# EAGLE schematic pocketbeagle-breakout (EAGLE 9.2.2)
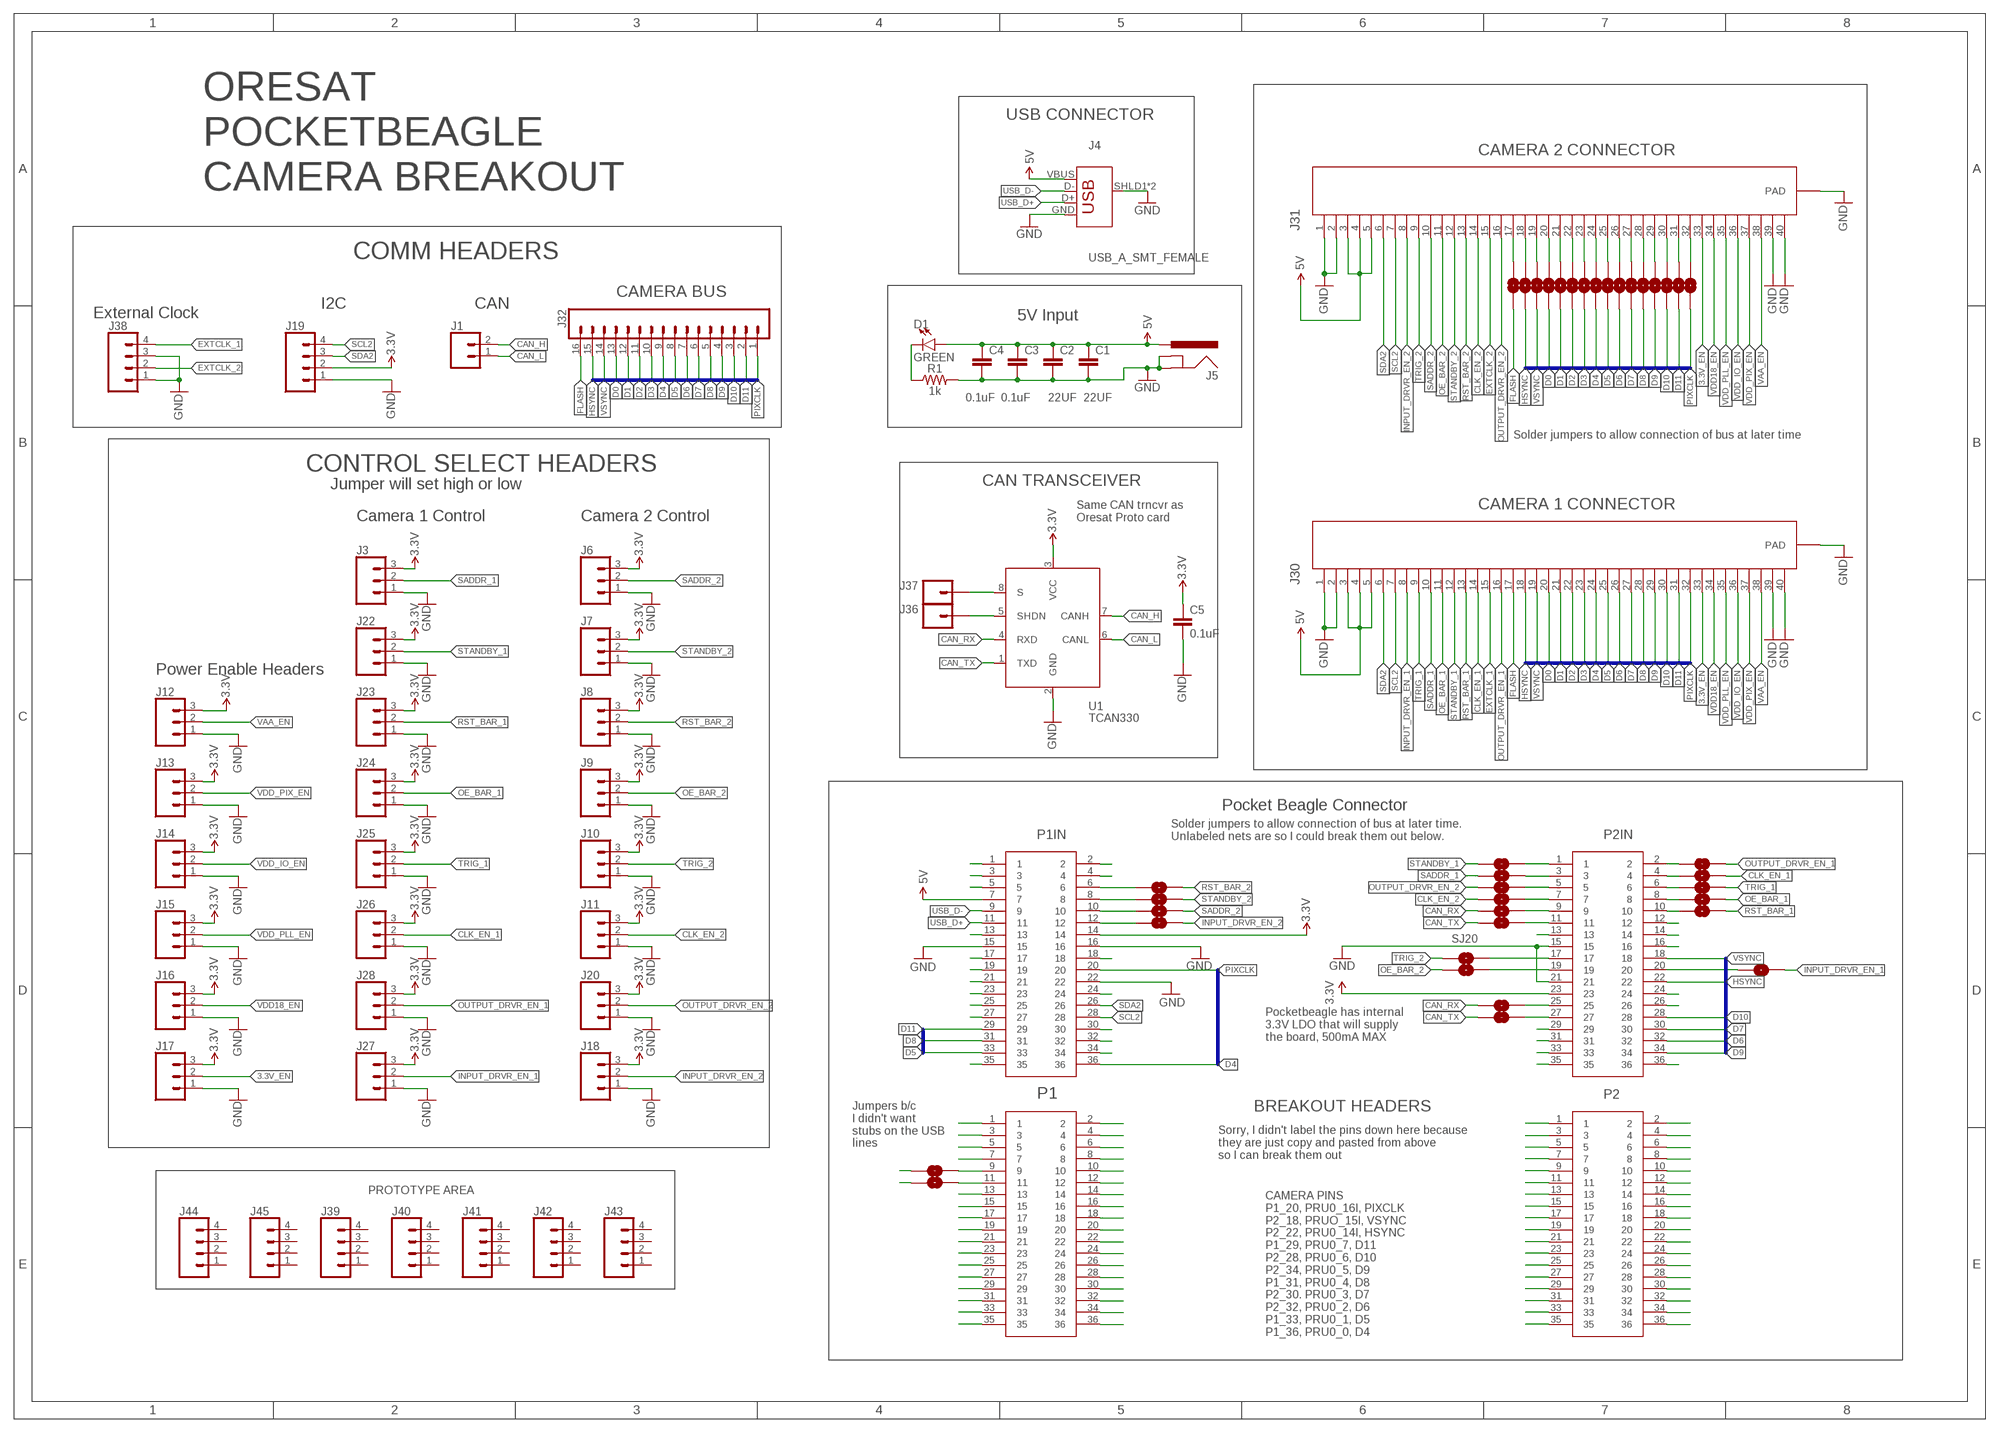
[diagram p0: schematic, sheet 1]

## Parts
C1  22UF  22UF-1210-16V-20%  [1210]
C2  22UF  22UF-1210-16V-20%  [1210]
C3  0.1uF  0.1UF-0603-100V-10%  [0603]
C4  0.1uF  0.1UF-0603-100V-10%  [0603]
C5  0.1uF  0.1UF-0603-100V-10%  [0603]
D1  GREEN  LED-GREEN0603  [LED-0603]
J1  CONN_025MM  [SCREWTERMINAL-5MM-2]
J3  CONN_031X03_NO_SILK  [1X03_NO_SILK]
J4  USB_A_SMT_FEMALE  [USB-A-S-SILK-FEMALE]
J5  POWER_JACK  [POWER_JACK_PTH]
J6  CONN_031X03_NO_SILK  [1X03_NO_SILK]
J7  CONN_031X03_NO_SILK  [1X03_NO_SILK]
J8  CONN_031X03_NO_SILK  [1X03_NO_SILK]
J9  CONN_031X03_NO_SILK  [1X03_NO_SILK]
J10  CONN_031X03_NO_SILK  [1X03_NO_SILK]
J11  CONN_031X03_NO_SILK  [1X03_NO_SILK]
J12  CONN_031X03_NO_SILK  [1X03_NO_SILK]
J13  CONN_031X03_NO_SILK  [1X03_NO_SILK]
J14  CONN_031X03_NO_SILK  [1X03_NO_SILK]
J15  CONN_031X03_NO_SILK  [1X03_NO_SILK]
J16  CONN_031X03_NO_SILK  [1X03_NO_SILK]
J17  CONN_031X03_NO_SILK  [1X03_NO_SILK]
J18  CONN_031X03_NO_SILK  [1X03_NO_SILK]
J19  CONN_041X04_NO_SILK  [1X04_NO_SILK]
J20  CONN_031X03_NO_SILK  [1X03_NO_SILK]
J22  CONN_031X03_NO_SILK  [1X03_NO_SILK]
J23  CONN_031X03_NO_SILK  [1X03_NO_SILK]
J24  CONN_031X03_NO_SILK  [1X03_NO_SILK]
J25  CONN_031X03_NO_SILK  [1X03_NO_SILK]
J26  CONN_031X03_NO_SILK  [1X03_NO_SILK]
J27  CONN_031X03_NO_SILK  [1X03_NO_SILK]
J28  CONN_031X03_NO_SILK  [1X03_NO_SILK]
J30  4-1734592-04-1734592-0  [TE_4-1734592-0]
J31  4-1734592-04-1734592-0  [TE_4-1734592-0]
J32  CONN_161X16_NO_SILK  [1X16_NO_SILK]
J36  CONN_01PTH_NO_SILK_YES_STOP  [1X01_NO_SILK]
J37  CONN_01PTH_NO_SILK_YES_STOP  [1X01_NO_SILK]
J38  CONN_041X04_NO_SILK  [1X04_NO_SILK]
J39  CONN_041X04_NO_SILK  [1X04_NO_SILK]
J40  CONN_041X04_NO_SILK  [1X04_NO_SILK]
J41  CONN_041X04_NO_SILK  [1X04_NO_SILK]
J42  CONN_041X04_NO_SILK  [1X04_NO_SILK]
J43  CONN_041X04_NO_SILK  [1X04_NO_SILK]
J44  CONN_041X04_NO_SILK  [1X04_NO_SILK]
J45  CONN_041X04_NO_SILK  [1X04_NO_SILK]
P1  BCS-118-L-D-TE  [CON36_2X18_TU_BCS]
P1IN  BCS-118-L-D-TE  [CON36_2X18_TU_BCS]
P2  BCS-118-L-D-TE  [CON36_2X18_TU_BCS]
P2IN  BCS-118-L-D-TE  [CON36_2X18_TU_BCS]
R1  1k  1KOHM-0603-1/10W-1%  [0603]
SJ1  SOLDERJUMPERNC2  [SJ_2S-NOTRACE]
SJ2  SOLDERJUMPERNC2  [SJ_2S-NOTRACE]
SJ3  SOLDERJUMPERNC2  [SJ_2S-NOTRACE]
SJ4  SOLDERJUMPERNC2  [SJ_2S-NOTRACE]
SJ5  SOLDERJUMPERNC2  [SJ_2S-NOTRACE]
SJ6  SOLDERJUMPERNC2  [SJ_2S-NOTRACE]
SJ7  SOLDERJUMPERNC2  [SJ_2S-NOTRACE]
SJ8  SOLDERJUMPERNC2  [SJ_2S-NOTRACE]
SJ9  SOLDERJUMPERNC2  [SJ_2S-NOTRACE]
SJ10  SOLDERJUMPERNC2  [SJ_2S-NOTRACE]
SJ11  SOLDERJUMPERNC2  [SJ_2S-NOTRACE]
SJ12  SOLDERJUMPERNC2  [SJ_2S-NOTRACE]
SJ13  SOLDERJUMPERNC2  [SJ_2S-NOTRACE]
SJ14  SOLDERJUMPERNC2  [SJ_2S-NOTRACE]
SJ15  SOLDERJUMPERNC2  [SJ_2S-NOTRACE]
SJ16  SOLDERJUMPERNC2  [SJ_2S-NOTRACE]
SJ17  SOLDERJUMPERNC  [SJ_2S]
SJ18  SOLDERJUMPERNC  [SJ_2S]
SJ19  SOLDERJUMPERTRACE  [SJ_2S-TRACE]
SJ20  SOLDERJUMPERTRACE  [SJ_2S-TRACE]
SJ21  SOLDERJUMPERNC  [SJ_2S]
SJ22  SOLDERJUMPERNC  [SJ_2S]
SJ23  SOLDERJUMPERNC  [SJ_2S]
SJ24  SOLDERJUMPERNC  [SJ_2S]
SJ25  SOLDERJUMPERNC  [SJ_2S]
SJ26  SOLDERJUMPERNC  [SJ_2S]
SJ27  SOLDERJUMPERNC  [SJ_2S]
SJ28  SOLDERJUMPERNC  [SJ_2S]
SJ29  SOLDERJUMPERNC  [SJ_2S]
SJ30  SOLDERJUMPERNC  [SJ_2S]
SJ31  SOLDERJUMPERNC  [SJ_2S]
SJ32  SOLDERJUMPERNC  [SJ_2S]
SJ33  SOLDERJUMPERNC  [SJ_2S]
SJ34  SOLDERJUMPERNC  [SJ_2S]
SJ35  SOLDERJUMPERNC  [SJ_2S]
SJ36  SOLDERJUMPERNC  [SJ_2S]
SJ37  SOLDERJUMPERNC  [SJ_2S]
SJ38  SOLDERJUMPERNC  [SJ_2S]
U1  TCAN330  [SOT23-8_TI-DCN]

## Nets
3.3V: C5.1 J3.3 J6.3 J7.3 J8.3 J9.3 J10.3 J11.3 J12.3 J13.3 J14.3 J15.3 J16.3 J17.3 J18.3 J19.2 J20.3 J22.3 J23.3 J24.3 J25.3 J26.3 J27.3 J28.3 P1.14 P1IN.14 P2.23 P2IN.23 U1.3(VCC)
3.3V_EN: J17.2 J30.33 J31.33
5V: C1.1 C2.1 C3.1 C4.1 D1.A J4.VBUS J5.PWR J30.3 J30.4 J30.5 J31.3 J31.4 J31.5 P1.7 P1IN.7
CAN_H: J1.2 U1.7(CANH)
CAN_L: J1.1 U1.6(CANL)
CAN_RX: SJ17.2 SJ19.2 U1.4(RXD)
CAN_TX: SJ18.2 SJ20.2 U1.1(TXD)
CLK_EN_1: J26.2 J30.14 SJ36.1
CLK_EN_2: J11.2 J31.14 SJ29.2
D0: J30.20 J32.13 SJ15.1
D1: J30.21 J32.12 SJ14.1
D2: J30.22 J32.11 SJ13.1
D3: J30.23 J32.10 SJ12.1
D4: J30.24 J32.9 P1.36 P1IN.36 SJ11.1
D5: J30.25 J32.8 P1.33 P1IN.33 SJ10.1
D6: J30.26 J32.7 P2.32 P2IN.32 SJ9.1
D7: J30.27 J32.6 P2.30 P2IN.30 SJ8.1
D8: J30.28 J32.5 P1.31 P1IN.31 SJ7.1
D9: J30.29 J32.4 P2.34 P2IN.34 SJ6.1
D10: J30.30 J32.3 P2.28 P2IN.28 SJ5.1
D11: J30.31 J32.2 P1.29 P1IN.29 SJ4.1
EXTCLK_1: J30.15 J38.4
EXTCLK_2: J31.15 J38.2
FLASH: J30.17 J32.16 SJ16.2
GND: C1.2 C2.2 C3.2 C4.2 C5.2 J3.1 J4.GND J4.SHLD1(SHIELD) J4.SHLD2(SHIELD) J5.GND J5.GNDBREAK J6.1 J7.1 J8.1 J9.1 J10.1 J11.1 J12.1 J13.1 J14.1 J15.1 J16.1 J17.1 J18.1 J19.1 J20.1 J22.1 J23.1 J24.1 J25.1 J26.1 J27.1 J28.1 J30.1 J30.2 J30.39 J30.40 J30.S1(PAD) J30.S2(PAD) J31.1 J31.2 J31.39 J31.40 J31.S1(PAD) J31.S2(PAD) J38.1 J38.3 P1.15 P1.16 P1.22 P1IN.15 P1IN.16 P1IN.22 P2.15 P2.21 P2IN.15 P2IN.21 R1.2 U1.2(GND)
HSYNC: J30.18 J32.15 P2.22 P2IN.22 SJ3.1
INPUT_DRVR_EN_1: J27.2 J30.8 SJ35.2
INPUT_DRVR_EN_2: J18.2 J31.8 SJ33.1
N$1: P2.2 P2IN.2 SJ34.1
N$2: J31.17 SJ16.1
N$3: J31.18 SJ3.2
N$4: J31.19 SJ2.2
N$5: J31.20 SJ15.2
N$6: J31.21 SJ14.2
N$7: J31.22 SJ13.2
N$8: J31.23 SJ12.2
N$9: J31.24 SJ11.2
N$10: J31.25 SJ10.2
N$11: J31.26 SJ9.2
N$12: J31.27 SJ8.2
N$13: J31.28 SJ7.2
N$14: J31.29 SJ6.2
N$15: J31.30 SJ5.2
N$16: J31.31 SJ4.2
N$17: J31.32 SJ1.2
N$18: J36.1 U1.5(SHDN)
N$19: J37.1 U1.8(S)
N$20: P2.9 P2IN.9 SJ19.1
N$21: P2.11 P2IN.11 SJ20.1
N$22: P2.25 P2IN.25 SJ17.1
N$23: P2.27 P2IN.27 SJ18.1
N$24: D1.C R1.1
N$25: P2.1 P2IN.1 SJ22.2
N$26: P2.10 P2IN.10 SJ23.2
N$27: P2.8 P2IN.8 SJ24.2
N$28: P2.6 P2IN.6 SJ25.2
N$29: P2.17 P2IN.17 SJ26.1
N$30: P2.19 P2IN.19 SJ27.1
N$31: P2.5 P2IN.5 SJ28.1
N$32: P2.7 P2IN.7 SJ29.1
N$33: P1.12 P1IN.12 SJ33.2
N$34: P1.10 P1IN.10 SJ32.2
N$35: P1.8 P1IN.8 SJ31.2
N$36: P1.6 P1IN.6 SJ30.2
N$37: P2.20 P2IN.20 SJ35.1
N$38: P2.4 P2IN.4 SJ36.2
N$39: P1.9 SJ37.1
N$40: P1.11 SJ38.1
N$41: P1.27 P1IN.27
N$42: P1.25 P1IN.25
N$43: P1.23 P1IN.23
N$44: P1.21 P1IN.21
N$45: P1.19 P1IN.19
N$46: P1.17 P1IN.17
N$47: P1.13 P1IN.13
N$48: P1.5 P1IN.5
N$49: P1.3 P1IN.3
N$50: P1.1 P1IN.1
N$51: P1.35 P1IN.35
N$52: P1.34 P1IN.34
N$53: P1.32 P1IN.32
N$54: P1.30 P1IN.30
N$55: P1.24 P1IN.24
N$56: P1.18 P1IN.18
N$57: P1.4 P1IN.4
N$58: P2.3 P2IN.3 SJ21.2
N$59: P1.2 P1IN.2
N$60: P2.13 P2IN.13
N$61: P2.29 P2IN.29
N$62: P2.31 P2IN.31
N$63: P2.33 P2IN.33
N$64: P2.35 P2IN.35
N$65: P2.12 P2IN.12
N$66: P2.14 P2IN.14
N$67: P2.16 P2IN.16
N$68: P2.24 P2IN.24
N$69: P2.26 P2IN.26
N$70: P2.36 P2IN.36
OE_BAR_1: J24.2 J30.11 SJ24.1
OE_BAR_2: J9.2 J31.11 SJ27.2
OUTPUT_DRVR_EN_1: J28.2 J30.16 SJ34.2
OUTPUT_DRVR_EN_2: J20.2 J31.16 SJ28.2
PIXCLK: J30.32 J32.1 P1.20 P1IN.20 SJ1.1
RST_BAR_1: J23.2 J30.13 SJ23.1
RST_BAR_2: J8.2 J31.13 SJ30.1
SADDR_1: J3.2 J30.10 SJ21.1
SADDR_2: J6.2 J31.10 SJ32.1
SCL2: J19.4 J30.7 J31.7 P1.28 P1IN.28
SDA2: J19.3 J30.6 J31.6 P1.26 P1IN.26
STANDBY_1: J22.2 J30.12 SJ22.1
STANDBY_2: J7.2 J31.12 SJ31.1
TRIG_1: J25.2 J30.9 SJ25.1
TRIG_2: J10.2 J31.9 SJ26.2
USB_D+: J4.D+ P1IN.11 SJ38.2
USB_D-: J4.D- P1IN.9 SJ37.2
VAA_EN: J12.2 J30.38 J31.38
VDD18_EN: J16.2 J30.34 J31.34
VDD_IO_EN: J14.2 J30.36 J31.36
VDD_PIX_EN: J13.2 J30.37 J31.37
VDD_PLL_EN: J15.2 J30.35 J31.35
VSYNC: J30.19 J32.14 P2.18 P2IN.18 SJ2.1
Unconnected: J39.1 J39.2 J39.3 J39.4 J40.1 J40.2 J40.3 J40.4 J41.1 J41.2 J41.3 J41.4 J42.1 J42.2 J42.3 J42.4 J43.1 J43.2 J43.3 J43.4 J44.1 J44.2 J44.3 J44.4 J45.1 J45.2 J45.3 J45.4

## Buses
D[0..11],HSYNC,PIXCLK,VSYNC

## Notes on the sheet
- USB CONNECTOR
- CAMERA 2 CONNECTOR
- ORESAT
  POCKETBEAGLE
  CAMERA BREAKOUT
- COMM HEADERS
- CAMERA BUS
- I2C | CAN
- External Clock | 5V Input
- Solder jumpers to allow connection of bus at later time
- CONTROL SELECT HEADERS
- Jumper will set high or low | CAN TRANSCEIVER
- CAMERA 1 CONNECTOR
- Camera 1 Control | Camera 2 Control
- Same CAN trncvr as 
  Oresat Proto card
- Power Enable Headers
- Pocket Beagle Connector
- Solder jumpers to allow connection of bus at later time.
  Unlabeled nets are so I could break them out below.
- Pocketbeagle has internal
  3.3V LDO that will supply
  the board, 500mA MAX
- BREAKOUT HEADERS
- Jumpers b/c
  I didn't want
  stubs on the USB
  lines
- Sorry, I didn't label the pins down here because 
  they are just copy and pasted from above
  so I can break them out
- PROTOTYPE AREA
- CAMERA PINS
  P1_20, PRU0_16I, PIXCLK
  P2_18, PRUO_15I, VSYNC
  P2_22, PRU0_14I, HSYNC
  P1_29, PRU0_7, D11
  P2_28, PRU0_6, D10
  P2_34, PRU0_5, D9
  P1_31, PRU0_4, D8
  P2_30. PRU0_3, D7
  P2_32, PRU0_2, D6
  P1_33, PRU0_1, D5
  P1_36, PRU0_0, D4

## Library data of the parts
C1 C2 = SparkFun-Capacitors:22UF: 22µF ceramic capacitors A capacitor is a passive two-terminal electrical component used to store electrical energy temporarily in an electric field.
C3-C5 = SparkFun-Capacitors:0.1UF: 0.1µF ceramic capacitors A capacitor is a passive two-terminal electrical component used to store electrical energy temporarily in an electric field.; PROD_ID: CAP-08390
D1 = SparkFun-LED:LED-GREEN: Green SMD LED Used in manufacturing of various products at SparkFun Packages: 0603 - SMD 0603 package [Product Link] <http://www.futureelectronics.com/en/technologies/semiconductors/optoelectronics/leds/Pages/9894312-LTST-C190GKT.aspx?CrossPart=HSMG-C190&IM=0> LilyPad 1206 - SMD1206 LilyPad package [Product Link] <http://www.futureelectronics.com/en/Technologies/Product.aspx?ProductID=IN150NGHARVATEKCORPORATION2049943&IM=0> 1206 - SMD1206 package [Product Link] <http://www.futureelectronics.com/en/technologies/semiconductors/optoelectronics/leds/Pages/8315665-LTST-C150KGKT.aspx?IM=0> 1206 Bottom Mount -SMD 1206 Bottom Mount [Product Link] <http://www.digikey.com/product-detail/en/lite-on-inc/LTST-C230KGKT/160-1456-1-ND/386854> SparkFun Products: Pro Mini 328 -5V <https://www.sparkfun.com/products/821> RedBoard <https://www.sparkfun.com/products/12757> MP3 Trigger <https://www.sparkfun.com/products/13720> Makey Makey <https://www.sparkfun.com/products/11076>; PROD_ID: DIO-00821
J1 = SparkFun-Connectors:CONN_02: Multi connection point. Often used as Generic Header-pin footprint for 0.1 inch spaced/style header connections On any of the 0.1 inch spaced packages, you can populate with these: Break Away Headers - Straight <https://www.sparkfun.com/products/116> (PRT-00116) Break Away Male Headers - Right Angle <https://www.sparkfun.com/products/553> (PRT-00553) Female Headers <https://www.sparkfun.com/products/115> (PRT-00115) Break Away Headers - Machine Pin <https://www.sparkfun.com/products/117> (PRT-00117) Break Away Female Headers - Swiss Machine Pin <https://www.sparkfun.com/products/743> (PRT-00743) For SCREWTERMINALS and SPRING TERMINALS visit here: Screw Terimnals on SparkFun.com <https://www.sparkfun.com/search/results?term=Screw+Terminals> (5mm/3.5mm/2.54mm spacing) This device is also useful as a general connection point to wire up your design to another part of your project. Our various solder wires solder well into these plated through hole pads. Hook-Up Wire - Assortment (Stranded, 22 AWG) <https://www.sparkfun.com/products/11375> (PRT-11375) Hook-Up Wire - Assortment (Solid Core, 22 AWG) <https://www.sparkfun.com/products/11367> (PRT-11367) View the entire wire category on our website here <https://www.sparkfun.com/categories/141> Special notes: Molex polarized connector foot print use with: PRT-08233 with associated crimp pins and housings. 2.54_SCREWTERM for use with PRT-10571. 3.5mm Screw Terminal footprints for PRT-08084 5mm Screw Terminal footprints for use with PRT-08432; SF_SKU: PRT-08432
J3 J6-J18 J20 J22-J28 = SparkFun-Connectors:CONN_03: Multi connection point. Often used as Generic Header-pin footprint for 0.1 inch spaced/style header connections On any of the 0.1 inch spaced packages, you can populate with these: Break Away Headers - Straight <https://www.sparkfun.com/products/116> (PRT-00116) Break Away Male Headers - Right Angle <https://www.sparkfun.com/products/553> (PRT-00553) Female Headers <https://www.sparkfun.com/products/115> (PRT-00115) Break Away Headers - Machine Pin <https://www.sparkfun.com/products/117> (PRT-00117) Break Away Female Headers - Swiss Machine Pin <https://www.sparkfun.com/products/743> (PRT-00743) Stackable Header - 3 Pin (Female, 0.1") <https://www.sparkfun.com/products/13875> (PRT-13875) For SCREWTERMINALS and SPRING TERMINALS visit here: Screw Terimnals on SparkFun.com <https://www.sparkfun.com/search/results?term=Screw+Terminals> (5mm/3.5mm/2.54mm spacing) This device is also useful as a general connection point to wire up your design to another part of your project. Our various solder wires solder well into these plated through hole pads. Hook-Up Wire - Assortment (Stranded, 22 AWG) <https://www.sparkfun.com/products/11375> (PRT-11375) Hook-Up Wire - Assortment (Solid Core, 22 AWG) <https://www.sparkfun.com/products/11367> (PRT-11367) View the entire wire category on our website here <https://www.sparkfun.com/categories/141> Special notes: Molex polarized connector foot print use with SKU : PRT-08232 with associated crimp pins and housings.
J4 = SparkFun-Connectors:USB_A: USB-A Connector Male and female variants, as well as PTH and SMT variants SparkFun Products: SparkFun XBee Explorer Dongle <https://www.sparkfun.com/products/11697> PTH Male SparkFun MicroView-USB Programmer <https://www.sparkfun.com/products/12924> SMT Male SparkFun USB Type A Female Breakout <https://www.sparkfun.com/products/12700> SMT Female; PROD_ID: CONN-09520; SF_ID: PRT-09011
J5 = SparkFun-Connectors:POWER_JACK: Power Jack Connector This is the standard 5.5mm barrel jack for power. The PTH is the most common, proven, reliable, footprint. The Slot footprint only works if the mill layer is transmitted to the PCB fab house so be warned. Here are the connectors we sell at SparkFun: DC Barrel Power Jack/Connector <https://www.sparkfun.com/products/119> (PRT-00119) DC Barrel Power Jack/Connector (SMD) <https://www.sparkfun.com/products/12748> (PRT-12748) DC Barrel Jack Adapter - Breadboard Compatible <https://www.sparkfun.com/products/10811> (PRT-10811) It is used on this SparkFun product (and many, many others): SparkFun RedBoard - Programmed with Arduino <https://www.sparkfun.com/products/12757> (DEV-12757) Also, if you need a mating power supply or connector, please check these out: Wall Adapter Power Supply - 9VDC 650mA <https://www.sparkfun.com/products/298> (TOL-00298) DC Barrel Jack Adapter - Male <https://www.sparkfun.com/products/10287> (PRT-10287); PROD_ID: CONN-08197
J19 J38-J45 = SparkFun-Connectors:CONN_04: Multi connection point. Often used as Generic Header-pin footprint for 0.1 inch spaced/style header connections On any of the 0.1 inch spaced packages, you can populate with these: Break Away Headers - Straight <https://www.sparkfun.com/products/116> (PRT-00116) Break Away Male Headers - Right Angle <https://www.sparkfun.com/products/553> (PRT-00553) Female Headers <https://www.sparkfun.com/products/115> (PRT-00115) Break Away Headers - Machine Pin <https://www.sparkfun.com/products/117> (PRT-00117) Break Away Female Headers - Swiss Machine Pin <https://www.sparkfun.com/products/743> (PRT-00743) For SCREWTERMINALS and SPRING TERMINALS visit here: Screw Terimnals on SparkFun.com <https://www.sparkfun.com/search/results?term=Screw+Terminals> (5mm/3.5mm/2.54mm spacing) This device is also useful as a general connection point to wire up your design to another part of your project. Our various solder wires solder well into these plated through hole pads. Hook-Up Wire - Assortment (Stranded, 22 AWG) <https://www.sparkfun.com/products/11375> (PRT-11375) Hook-Up Wire - Assortment (Solid Core, 22 AWG) <https://www.sparkfun.com/products/11367> (PRT-11367) View the entire wire category on our website here <https://www.sparkfun.com/categories/141> Special notes: Molex polarized connector foot print use with SKU : PRT-08231 with associated crimp pins and housings. 1MM SMD Version SKU: PRT-10208; PROD_ID: CONN-09696
J30 J31 = Oliver_Custom:4-1734592-0
J32 = SparkFun-Connectors:CONN_16: Multi connection point. Often used as Generic Header-pin footprint for 0.1 inch spaced/style header connections On any of the 0.1 inch spaced packages, you can populate with these: Break Away Headers - Straight <https://www.sparkfun.com/products/116> (PRT-00116) Break Away Male Headers - Right Angle <https://www.sparkfun.com/products/553> (PRT-00553) Female Headers <https://www.sparkfun.com/products/115> (PRT-00115) Break Away Headers - Machine Pin <https://www.sparkfun.com/products/117> (PRT-00117) Break Away Female Headers - Swiss Machine Pin <https://www.sparkfun.com/products/743> (PRT-00743) For SCREWTERMINALS and SPRING TERMINALS visit here: Screw Terimnals on SparkFun.com <https://www.sparkfun.com/search/results?term=Screw+Terminals> (5mm/3.5mm/2.54mm spacing) This device is also useful as a general connection point to wire up your design to another part of your project. Our various solder wires solder well into these plated through hole pads. Hook-Up Wire - Assortment (Stranded, 22 AWG) <https://www.sparkfun.com/products/11375> (PRT-11375) Hook-Up Wire - Assortment (Solid Core, 22 AWG) <https://www.sparkfun.com/products/11367> (PRT-11367) View the entire wire category on our website here <https://www.sparkfun.com/categories/141> Special notes: Molex polarized connector foot print use with SKU : PRT-08231 with associated crimp pins and housings. 1MM SMD Version SKU: PRT-10208 NOTES ON THE VARIANTS LOCK and LOCK_LONGPADS... This footprint was designed to help hold the alignment of a through-hole component (i.e. 6-pin header) while soldering it into place. You may notice that each hole has been shifted either up or down by 0.005 of an inch from it's more standard position (which is a perfectly straight line). This slight alteration caused the pins (the squares in the middle) to touch the edges of the holes. Because they are alternating, it causes a "brace" to hold the component in place. 0.005 has proven to be the perfect amount of "off-center" position when using our standard breakaway headers. Although looks a little odd when you look at the bare footprint, once you have a header in there, the alteration is very hard to notice. Also,if you push a header all the way into place, it is covered up entirely on the bottom side.
J36 J37 = SparkFun-Connectors:CONN_01: Single connection point. Often used as Generic Header-pin footprint for 0.1 inch spaced/style header connections On any of the 0.1 inch spaced packages, you can populate with these: Break Away Headers - Straight <https://www.sparkfun.com/products/116> (PRT-00116) Break Away Male Headers - Right Angle <https://www.sparkfun.com/products/553> (PRT-00553) Female Headers <https://www.sparkfun.com/products/115> (PRT-00115) Break Away Headers - Machine Pin <https://www.sparkfun.com/products/117> (PRT-00117) Break Away Female Headers - Swiss Machine Pin <https://www.sparkfun.com/products/743> (PRT-00743) This device is also useful as a general connection point to wire up your design to another part of your project. Our various solder wires solder well into these plated through hole pads. Hook-Up Wire - Assortment (Stranded, 22 AWG) <https://www.sparkfun.com/products/11375> (PRT-11375) Hook-Up Wire - Assortment (Solid Core, 22 AWG) <https://www.sparkfun.com/products/11367> (PRT-11367) View the entire wire category on our website here <https://www.sparkfun.com/categories/141> Special notes: SMTSO-256-ET is a "flush mount" nut for a 4-40 screw. We mostly use this on specialty testbeds; it is a nice way to connect hardware to your PCB at an adjustable hieght. Also note, the SNAP packages are for using a snappable style connector. We sell a baggie of snaps and they are also used on two LilyPad designs: Snap Assortment - 30 pack (male and female) <https://www.sparkfun.com/products/11347> (DEV-11347) LilyPad Arduino SimpleSnap <https://www.sparkfun.com/products/10941> (DEV-10941) LilyPad SimpleSnap Protoboard <https://www.sparkfun.com/products/10940> (DEV-10940)
P1 P1IN P2 P2IN = J-SAMTEC-2x18-BCS-118-L-D-TE:BCS-118-L-D-TE; MANUFACTURER_PART_NUMBER: BCS118LDTE; VENDOR: Samtec Inc
R1 = SparkFun-Resistors:1KOHM: 1kΩ resistor A resistor is a passive two-terminal electrical component that implements electrical resistance as a circuit element. Resistors act to reduce current flow, and, at the same time, act to lower voltage levels within circuits. - Wikipedia; PROD_ID: RES-07856
SJ1-SJ38 = SparkFun-Passives:SOLDERJUMPER: Solder Jumper Standard SMD solder jumper. Used to automate production. Two varients : Normally Open and Normally Closed are the same, but have different paste layers. NC will have a large amount of paste and should jumper during reflow.
U1 = U-TI-TCAN330-CAN-transceiver:TCAN330